# EAGLE schematic variant1_rev- (EAGLE 9.1.0)
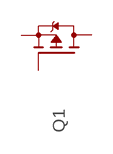
[diagram p0: schematic, sheet 1]

## Parts
Q1  IXTH96P085T  [TO-247H]
Unconnected: Q1.1(G) Q1.2(D) Q1.3(S)

## Library data of the parts
Q1 = kj4qlp:IXTH96P085T